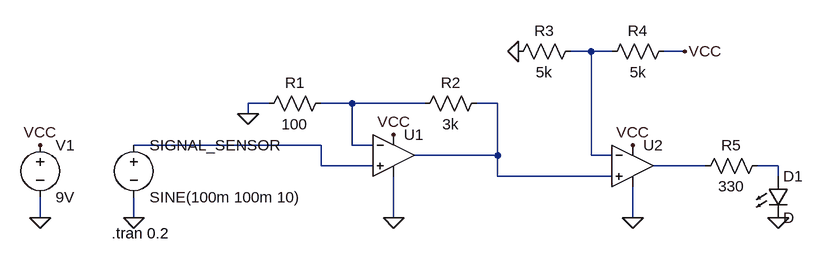
[diagram p0: schematic Draft1.asc]
Draft1.asc, the LTspice schematic file:
Version 4
SHEET 1 1132 680
WIRE 784 0 752 0
WIRE 816 0 784 0
WIRE 928 0 896 0
WIRE 288 80 256 80
WIRE 416 80 368 80
WIRE 528 80 416 80
WIRE 640 80 608 80
WIRE 256 96 256 80
WIRE 368 144 80 144
WIRE 416 144 416 80
WIRE 448 144 416 144
WIRE 640 160 640 80
WIRE 640 160 512 160
WIRE 784 160 784 0
WIRE 816 160 784 160
WIRE 368 176 368 144
WIRE 448 176 368 176
WIRE 960 176 880 176
WIRE 1072 176 1040 176
WIRE 640 192 640 160
WIRE 816 192 640 192
WIRE 1072 192 1072 176
WIRE -64 256 -64 224
WIRE 80 256 80 224
WIRE 480 256 480 192
WIRE 848 256 848 208
FLAG 80 256 0
FLAG 480 256 0
FLAG 480 128 VCC
FLAG 256 96 0
FLAG -64 256 0
FLAG -64 144 VCC
FLAG 928 0 VCC
FLAG 672 0 0
FLAG 848 256 0
FLAG 848 144 VCC
FLAG 1072 256 0
SYMBOL voltage 80 128 R0
WINDOW 123 0 0 Left 2
WINDOW 39 0 0 Left 2
SYMATTR InstName SIGNAL_SENSOR
SYMATTR Value SINE(100m 100m 10)
SYMBOL Opamps\\UniversalOpamp2 480 160 R0
SYMATTR InstName U1
SYMBOL res 384 64 R90
WINDOW 0 0 56 VBottom 2
WINDOW 3 32 56 VTop 2
SYMATTR InstName R1
SYMATTR Value 100
SYMBOL res 624 64 R90
WINDOW 0 0 56 VBottom 2
WINDOW 3 32 56 VTop 2
SYMATTR InstName R2
SYMATTR Value 3k
SYMBOL voltage -64 128 R0
WINDOW 123 0 0 Left 2
WINDOW 39 0 0 Left 2
SYMATTR InstName V1
SYMATTR Value 9V
SYMBOL Opamps\\UniversalOpamp2 848 176 R0
SYMATTR InstName U2
SYMBOL res 768 -16 R90
WINDOW 0 0 56 VBottom 2
WINDOW 3 32 56 VTop 2
SYMATTR InstName R3
SYMATTR Value 5k
SYMBOL res 912 -16 R90
WINDOW 0 0 56 VBottom 2
WINDOW 3 32 56 VTop 2
SYMATTR InstName R4
SYMATTR Value 5k
SYMBOL LED 1056 192 R0
SYMATTR InstName D1
SYMBOL res 1056 160 R90
WINDOW 0 0 56 VBottom 2
WINDOW 3 32 56 VTop 2
SYMATTR InstName R5
SYMATTR Value 330
TEXT 46 280 Left 2 !.tran 0.2

The netlist it stands for:
* Draft1.asc
V§SIGNAL_SENSOR N004 0 SINE(100m 100m 10)
XU1 N004 N002 VCC 0 N003 level.2 Avol=1Meg GBW=10Meg Slew=10Meg ilimit=25m rail=0 Vos=0 phimargin=45 en=0 enk=0 in=0 ink=0 Rin=500Meg  ; pins IN+ IN- V+ V- OUT
R1 N002 0 100
R2 N003 N002 3k
V1 VCC 0 9V
XU2 N003 N001 VCC 0 N005 level.2 Avol=1Meg GBW=10Meg Slew=10Meg ilimit=25m rail=0 Vos=0 phimargin=45 en=0 enk=0 in=0 ink=0 Rin=500Meg  ; pins IN+ IN- V+ V- OUT
R3 N001 0 5k
R4 VCC N001 5k
D1 N006 0 D
R5 N006 N005 330
.model D D
.lib standard.dio
.tran 0.2
.lib UniversalOpamps2.sub
.backanno
.end